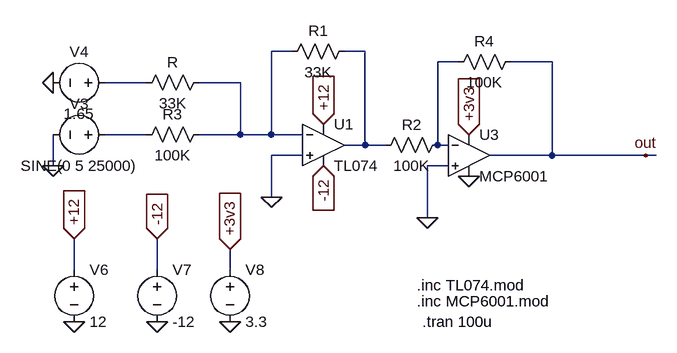
[diagram p0: schematic CVIN_FINAL.asc]
CVIN_FINAL.asc, the LTspice schematic file:
Version 4
SHEET 1 976 792
WIRE 400 224 368 224
WIRE 512 224 480 224
WIRE 656 240 624 240
WIRE 800 240 736 240
WIRE 176 272 112 272
WIRE 320 272 256 272
WIRE 176 352 112 352
WIRE 320 352 320 272
WIRE 320 352 256 352
WIRE 368 352 368 224
WIRE 368 352 320 352
WIRE 416 352 368 352
WIRE 512 368 512 224
WIRE 512 368 480 368
WIRE 544 368 512 368
WIRE 624 368 624 240
WIRE 640 368 624 368
WIRE 416 384 368 384
WIRE 800 384 800 240
WIRE 800 384 704 384
WIRE 944 384 800 384
WIRE 960 384 944 384
WIRE 32 400 32 352
WIRE 640 400 608 400
WIRE 368 448 368 384
WIRE 608 480 608 400
WIRE 64 560 64 512
WIRE 192 560 192 512
WIRE 304 560 304 528
FLAG 448 400 -12
IOPIN 448 400 In
FLAG 448 336 +12
IOPIN 448 336 In
FLAG 368 448 0
FLAG 32 400 0
FLAG 32 272 0
FLAG 944 384 out
FLAG 672 416 0
FLAG 672 352 +3v3
IOPIN 672 352 In
FLAG 608 480 0
FLAG 64 640 0
FLAG 192 640 0
FLAG 64 512 +12
IOPIN 64 512 In
FLAG 192 512 -12
IOPIN 192 512 In
FLAG 304 528 +3v3
IOPIN 304 528 In
FLAG 304 640 0
SYMBOL Opamps/opamp2 448 304 R0
SYMATTR InstName U1
SYMATTR Value TL074
SYMBOL res 384 240 R270
WINDOW 0 32 56 VTop 2
WINDOW 3 0 56 VBottom 2
SYMATTR InstName R1
SYMATTR Value 33K
SYMBOL res 160 288 R270
WINDOW 0 32 56 VTop 2
WINDOW 3 0 56 VBottom 2
SYMATTR InstName R
SYMATTR Value 33K
SYMBOL res 272 336 R90
WINDOW 0 0 56 VBottom 2
WINDOW 3 32 56 VTop 2
SYMATTR InstName R3
SYMATTR Value 100K
SYMBOL res 752 224 R90
WINDOW 0 0 56 VBottom 2
WINDOW 3 32 56 VTop 2
SYMATTR InstName R4
SYMATTR Value 100K
SYMBOL voltage 128 352 R90
WINDOW 0 -32 56 VBottom 2
WINDOW 3 32 56 VTop 2
SYMATTR InstName V3
SYMATTR Value SINE(0 5 25000)
SYMATTR Value2 AC 11
SYMBOL voltage 128 272 R90
WINDOW 0 -32 56 VBottom 2
WINDOW 3 32 56 VTop 2
SYMATTR InstName V4
SYMATTR Value 1.65
SYMBOL res 640 352 R90
WINDOW 0 0 56 VBottom 2
WINDOW 3 32 56 VTop 2
SYMATTR InstName R2
SYMATTR Value 100K
SYMBOL MCP6001 672 320 R0
SYMATTR InstName U3
SYMBOL voltage 64 544 R0
SYMATTR InstName V6
SYMATTR Value 12
SYMBOL voltage 192 544 R0
SYMATTR InstName V7
SYMATTR Value -12
SYMBOL voltage 304 544 R0
SYMATTR InstName V8
SYMATTR Value 3.3
TEXT 592 584 Left 2 !.inc TL074.mod
TEXT 600 640 Left 2 !.tran 100u
TEXT 592 608 Left 2 !.inc MCP6001.mod

The netlist it stands for:
* CVIN_FINAL.asc
XU1 0 N001 +12 -12 N002 TL074  ; pins In+ In- V+ V- OUT
R1 N001 N002 33K
R N004 N001 33K
R3 N001 N005 100K
R4 out N003 100K
V3 N005 0 SINE(0 5 25000) AC 11
V4 N004 0 1.65
R2 N003 N002 100K
* U3: MCP6001 (symbol MCP6001 not available, pins judged from their places): In+=0 In-=N003 V+=+3v3 V-=0 OUT=out
V6 +12 0 12
V7 -12 0 -12
V8 +3v3 0 3.3
.inc TL074.mod
.tran 100u
.inc MCP6001.mod
.backanno
.end